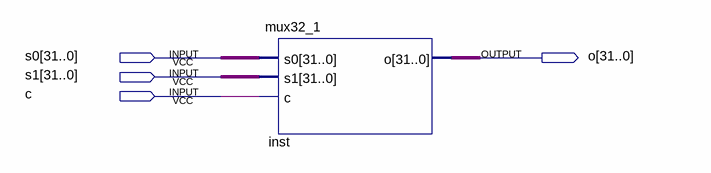
[diagram p0: schematic sheet]
// Quartus schematic teste_mux.bdf as structural Verilog: 1 symbols, 4 pins
module teste_mux (
  input  [31:0] s0,
  input  [31:0] s1,
  input  c,
  output [31:0] o
);

  mux32_1 inst (.s0(s0), .s1(s1), .c(c), .o(o));
endmodule
